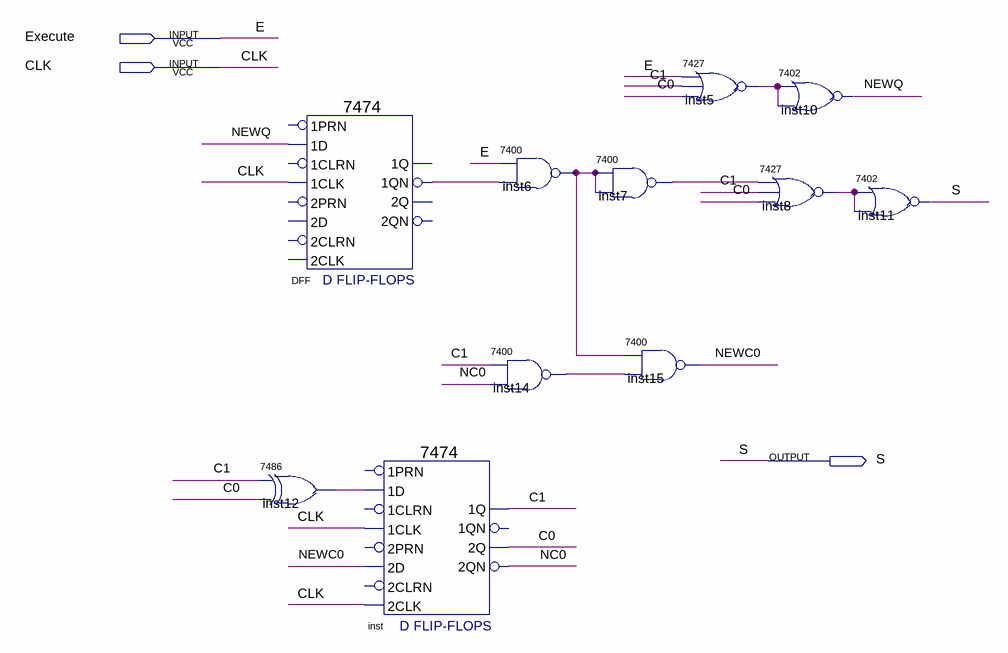
[diagram p0: schematic sheet]
// Quartus schematic control_logic.bdf as structural Verilog: 11 symbols, 3 pins
module control_logic (
  input  Execute,
  input  CLK,
  output S
);

  wire C0, C1, DFF_1qn, inst5_1, inst6_1, inst7_1, inst8_1, inst12_1, inst14_1, NC0, NEWC0, NEWQ;

  \7486  inst12 (.\2 (C1), .\3 (C0), .\1 (inst12_1));
  \7474  DFF (.\1CLK (CLK), .\1D (NEWQ), .\1QN (DFF_1qn));  // open: 2D, 2PRN, 1PRN, 2CLK, 2CLRN, 1CLRN, 2Q, 2QN, 1Q
  \7474  inst (
    .\2D (NEWC0), .\1CLK (CLK), .\1D (inst12_1), .\2CLK (CLK), .\2Q (C0), .\2QN (NC0), .\1Q (C1));  // open: 2PRN, 1PRN, 2CLRN, 1CLRN, 1QN
  \7400  inst14 (.\3 (NC0), .\2 (C1), .\1 (inst14_1));
  \7400  inst6 (.\3 (DFF_1qn), .\2 (Execute), .\1 (inst6_1));
  \7400  inst7 (.\3 (inst6_1), .\2 (inst6_1), .\1 (inst7_1));
  \7400  inst15 (.\3 (inst14_1), .\2 (inst6_1), .\1 (NEWC0));
  \7427  inst5 (.\4 (C0), .\3 (C1), .\2 (Execute), .\1 (inst5_1));
  \7402  inst10 (.\2 (inst5_1), .\3 (inst5_1), .\1 (NEWQ));
  \7427  inst8 (.\4 (C0), .\3 (C1), .\2 (inst7_1), .\1 (inst8_1));
  \7402  inst11 (.\2 (inst8_1), .\3 (inst8_1), .\1 (S));

  // Other names for the same wires on the sheet: E = Execute
endmodule
